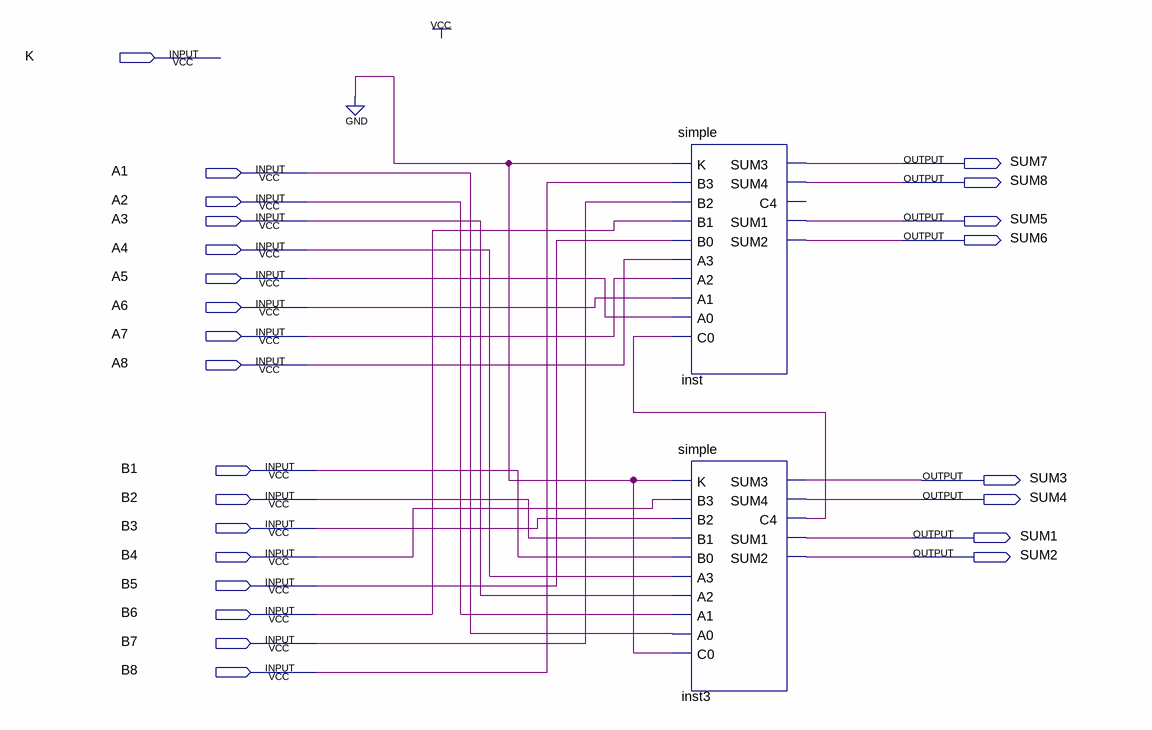
[diagram p0: schematic sheet]
// Quartus schematic addition.bdf as structural Verilog: 2 symbols, 25 pins
module addition (
  input  K,
  input  A1,
  input  A2,
  input  A3,
  input  A4,
  input  A5,
  input  A6,
  input  A7,
  input  A8,
  input  B1,
  input  B2,
  input  B3,
  input  B4,
  input  B5,
  input  B6,
  input  B7,
  input  B8,
  output SUM7,
  output SUM8,
  output SUM5,
  output SUM6,
  output SUM3,
  output SUM4,
  output SUM1,
  output SUM2
);

  wire inst3_c4;

  simple inst (
    .K(1'b0), .B3(B8), .B2(B7), .B1(B6), .B0(B5), .A3(A8), .A2(A7), .A1(A6), .A0(A5), .C0(inst3_c4),
    .SUM3(SUM7), .SUM4(SUM8), .SUM1(SUM5), .SUM2(SUM6));  // open: C4
  simple inst3 (
    .K(1'b0), .B3(B4), .B2(B3), .B1(B2), .B0(B1), .A3(A4), .A2(A3), .A1(A2), .A0(A1), .C0(1'b0), .SUM3(SUM3),
    .SUM4(SUM4), .C4(inst3_c4), .SUM1(SUM1), .SUM2(SUM2));
endmodule
